# Altium schematic sheet MachDoNuoc.SchDoc
size OrCAD A; SheetNumber: 1; SheetTotal: 1
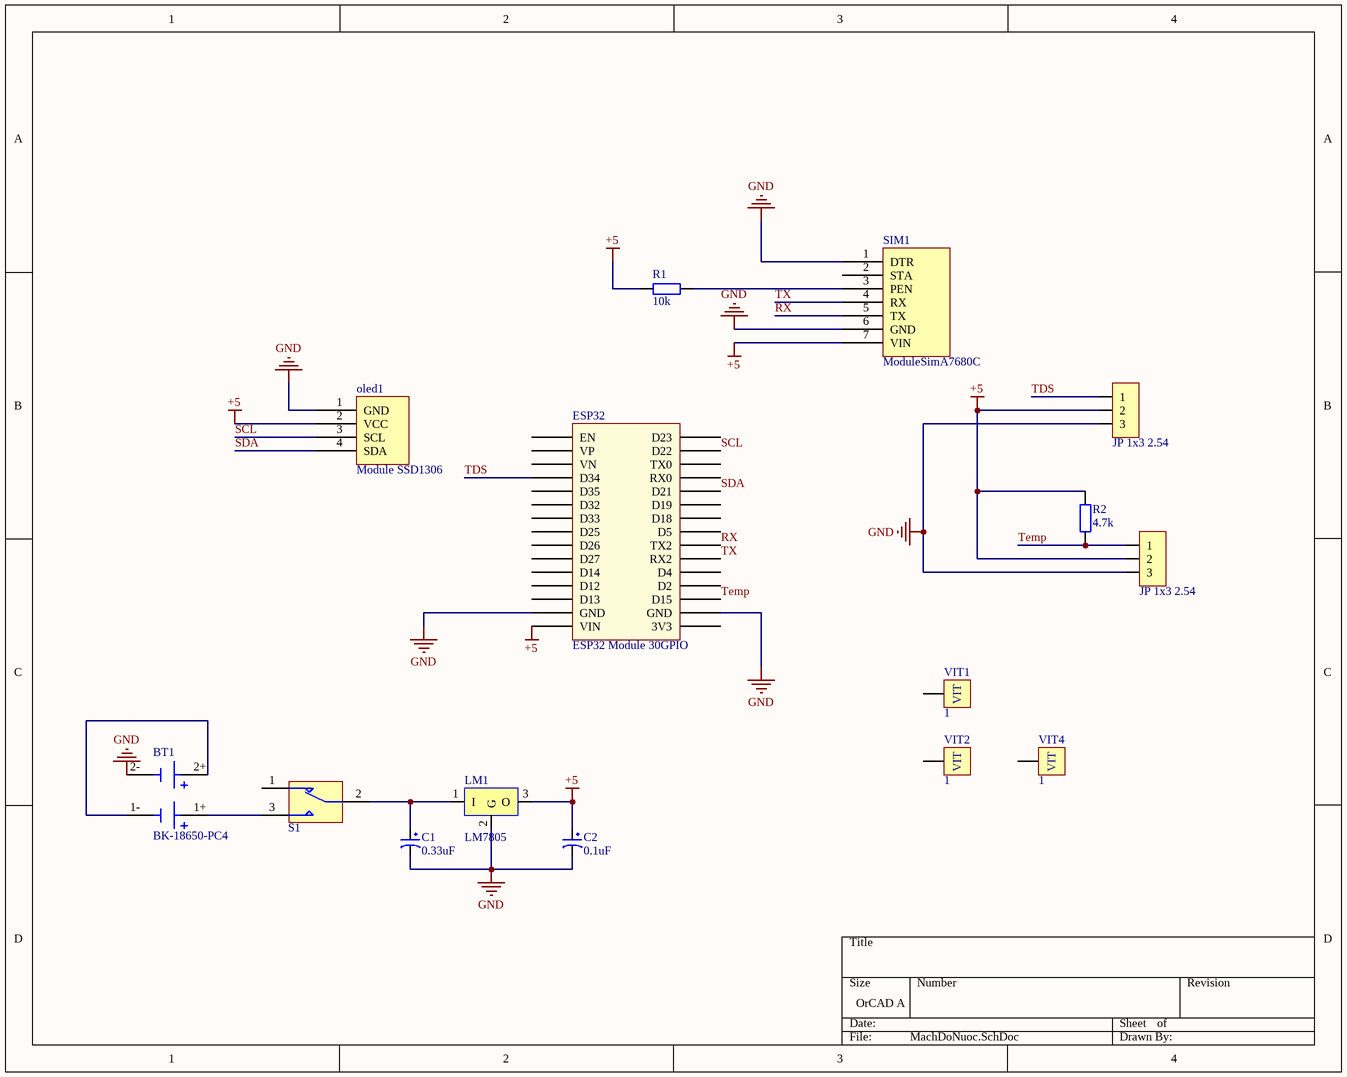
[diagram p0: MachDoNuoc.SchDoc]

## Parts
BT1  BK-18650-PC4  [BAT_BK-18650-PC4]
C1  0.33uF  [tu hoa 5mm]
C2  0.1uF  [tu hoa 5mm]
ESP32  ESP32 Module 30GPIO  [ESP32 Module 30GPIO_v2]
JP1  JP 1x3 2.54  [JP 1x3 DT]
JP2  JP 1x3 2.54  [JP 1x3 DT]
LM1  LM7805  [TO220H1]
oled1  Module SSD1306  [Module SSD1306]
R1  10k  [tro vach 1w]
R2  4.7k  [tro vach 1w]
S1  Switch SPDT_Subminiator  [SPDT Subminiator]  (value not drawn)
SIM1  ModuleSimA7680C  [JP 1X7 CT]
VIT1  1  [Screw octagon 3.81mm]
VIT2  1  [Screw octagon 3.81mm]
VIT4  1  [Screw octagon 3.81mm]

## Nets
+5: C2.1 ESP32.30(VIN) JP1.2 JP2.2 LM1.3(O) oled1.2(VCC) R1.1 R2.2 SIM1.7(VIN)
GND: BT1.2- C1.2 C2.2 ESP32.14(GND) ESP32.29(GND) JP1.3 JP2.3 LM1.2(G) oled1.1(GND) SIM1.1(DTR) SIM1.6(GND)
RX: ESP32.9(TX2) SIM1.5(TX)
SCL: ESP32.2(D22) oled1.3(SCL)
SDA: ESP32.5(D21) oled1.4(SDA)
TDS: ESP32.19(D34) JP1.1
Temp: ESP32.13(D15) JP2.1 R2.1
TX: ESP32.10(RX2) SIM1.4(RX)
NetBT1_1+: BT1.1+ S1.3
NetBT1_1-: BT1.1- BT1.2+
NetC1_1: C1.1 LM1.1(I) S1.2
NetR1_2: R1.2 SIM1.3(PEN)

Not connected (* = marked no-connect by the designer): ESP32 1(D23) 3(TX0) 4(RX0) 6(D19) 7(D18) 8(D5) 11(D4) 12(D2) 15(3V3) 16(EN) 17(VP) 18(VN) 20(D35) 21(D32) 22(D33) 23(D25) 24(D26) 25(D27) 26(D14) 27(D12) 28(D13); S1 1; SIM1 2(STA); VIT1 1; VIT2 1; VIT4 1

## Library data of the parts
BT1 = BK-18650-PC4: Battery Holder (Open) 18650 2 Cell PC Pin; Price: None; Value: *; Package: None; Availability: Unavailable; MP: BK-18650-PC4
C1 = Tu Hoa 0.33uF 50V 5x11: Cắm; Don_Vi: Con; So_Chan: 2; Ten_Linh_Kien: Tụ Hóa 0.33uF 50V 5x11MM; Ma_Hang: MH004655; Chung_Loai: Cắm; Kieu_Chan: *
C2 = Tu Hoa 0.1uF 50V 5x11: Cắm; Don_Vi: Con; So_Chan: 2; Ten_Linh_Kien: Tụ Hóa 0.1uF 50V; Ma_Hang: MH006853; Chung_Loai: Cắm; Kieu_Chan: *
JP1 JP2 = JP 1x3 2.54 Duc Thang: Cắm; Ten_Linh_Kien: Jump Đơn Đực 2.54MM 1x40P Thẳng 11MM; Don_Vi: Con; Ma_Hang: MH000903; Ghi_Chu: *; Kieu_Chan: *; Chung_Loai: Cắm
LM1 = LM78xx: IC REG LDO 5V 1A TO220-3
R1 = Tro Vach 1W 5% 10k: Cắm; Don_Vi: Con; So_Chan: 2; Ten_Linh_Kien: Trở 5% 1w 10k; Ma_Hang: MH006391; Chung_Loai: Cắm; Kieu_Chan: *
R2 = Tro Vach 1W 5% 4.7k: Cắm; Don_Vi: Con; So_Chan: 2; Ten_Linh_Kien: Trở 5% 1w 4.7k; Ma_Hang: MH006407; Chung_Loai: Cắm; Kieu_Chan: *
S1 = Switch SPDT_Subminiator: Subminiator SPDT Switch; Company: E.P.I.L; Design date: 2011/11/02
VIT1 VIT2 VIT4 = VIT: Vit xuyen lo; Chung_Loai: Cắm; Ma_Hang: MH002051; Ten_Linh_Kien: CON 2 KF142R 5.08MM; Don_Vi: Con; Ghi_Chu: *; Kieu_Chan: *